# Altium schematic sheet Main.SchDoc
size A4; SheetNumber: 1; SheetTotal: 5
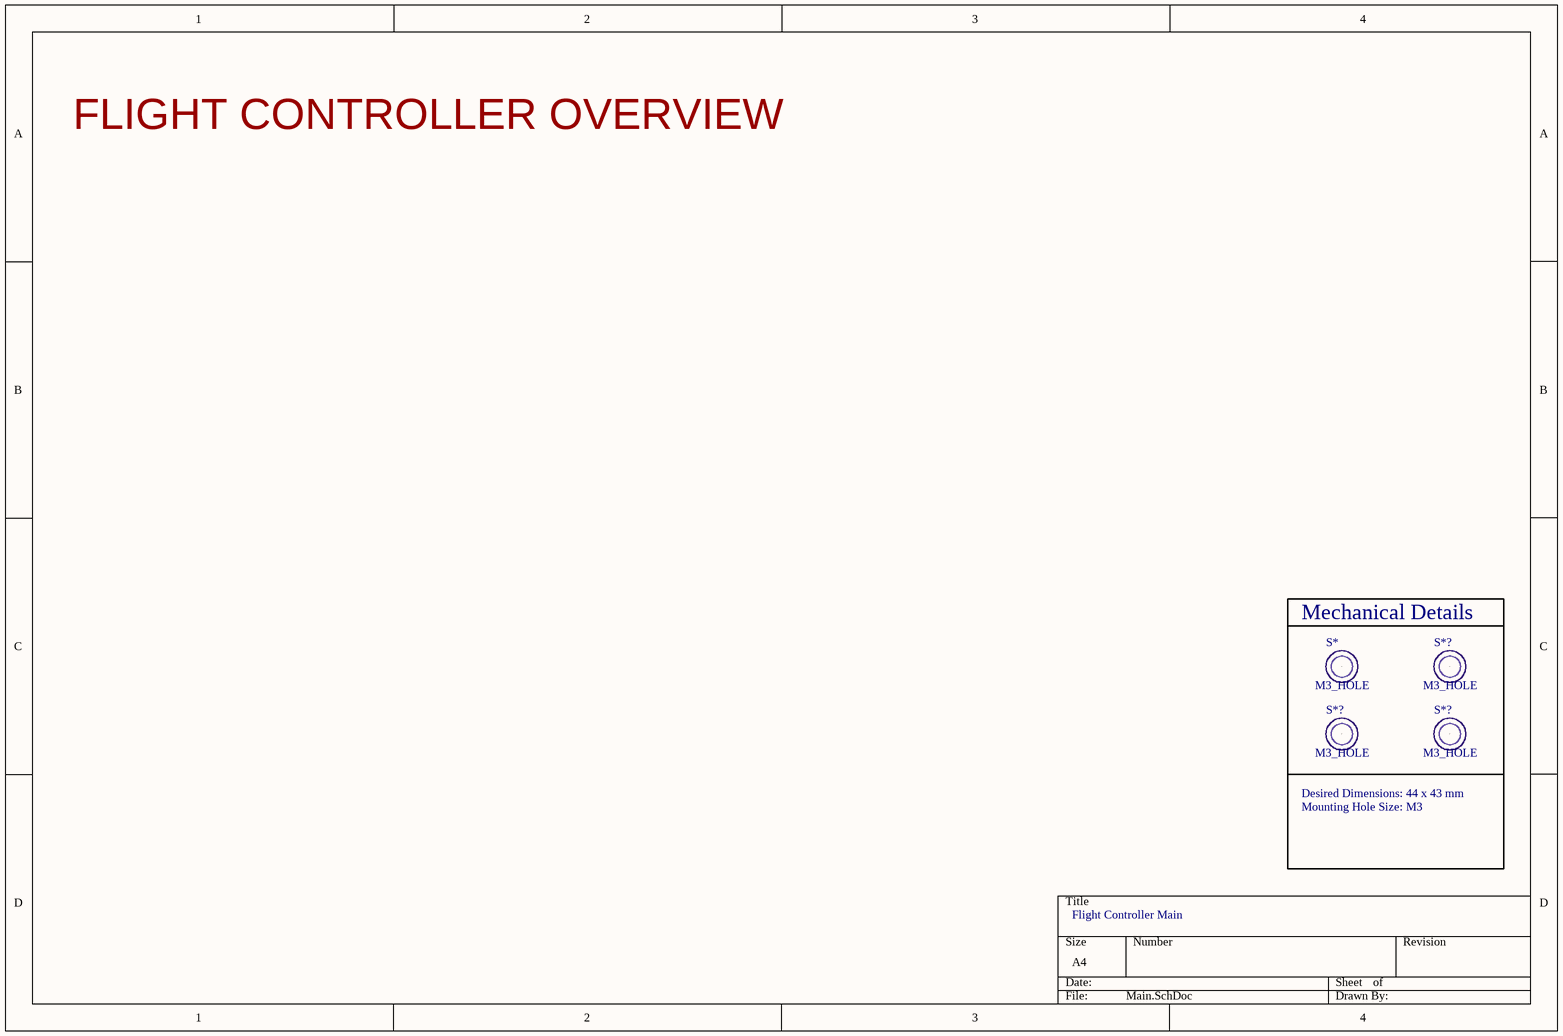
[diagram p0: Main.SchDoc]

## Parts
(Parts that share a designator on the sheet are numbered #1, #2 ... from top to bottom, then left to right.)
S*  M3_HOLE  [M3 Screw Hole Footprint]
S*?#1  M3_HOLE  [M3 Screw Hole Footprint]
S*?#2  M3_HOLE  [M3 Screw Hole Footprint]
S*?#3  M3_HOLE  [M3 Screw Hole Footprint]

## Nets

Not connected (* = marked no-connect by the designer): S* 0; S*?#1 0; S*?#2 0; S*?#3 0

## Notes on the sheet
- FLIGHT CONTROLLER OVERVIEW
- Mechanical Details
- Desired Dimensions: 44 x 43 mm
- Mounting Hole Size: M3
- Flight Controller Main

## Library data of the parts
S* S*?#1-S*?#3 = CMP-00045-5: Standard sized M3 screw mounting hole